# Altium project MB1296-STM32_LRA_Disco.PrjPcb
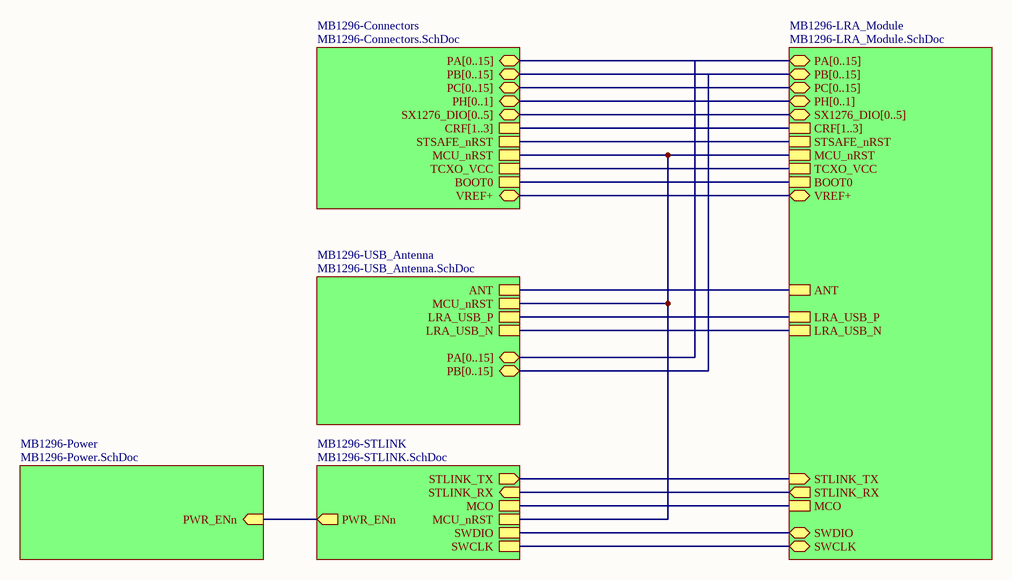
[diagram p0: MB1296-Top.SchDoc]
6 sheets, 178 parts. Net scope: hierarchical (ports join the sheet entries above them; power ports are global).
Board file: MB1296-STM32_LRA_Disco_revC01.PcbDoc
Sheets:
  MB1296-Top.SchDoc
    MB1296-Connectors = MB1296-Connectors.SchDoc
    MB1296-USB_Antenna = MB1296-USB_Antenna.SchDoc
    MB1296-STLINK = MB1296-STLINK.SchDoc
    MB1296-LRA_Module = MB1296-LRA_Module.SchDoc
    MB1296-Power = MB1296-Power.SchDoc

## Sheet MB1296-Top.SchDoc: Top
size A4; Date: 18-AUG-2016; Organization: STMicroelectronics; Address1: Microcontrollers Division; Address2: 190, avenue Célestin COQ; Address3: 13106 ROUSSET Cedex; Address4: FRANCE; DocumentNumber: MB1296; Revision: C-01; SheetNumber: 1; SheetTotal: 6; Project: STM32 LoRa Discovery

### Sub-sheets
MB1296-Connectors = MB1296-Connectors.SchDoc: PA[0..15] (bidir), PB[0..15] (bidir), PC[0..15] (bidir), MCU_nRST, BOOT0, SX1276_DIO[0..5] (bidir), CRF[1..3], TCXO_VCC, PH[0..1] (bidir), STSAFE_nRST, VREF+
MB1296-LRA_Module = MB1296-LRA_Module.SchDoc: LRA_USB_P, LRA_USB_N, STLINK_TX (in), STLINK_RX (out), ANT, STSAFE_nRST, MCU_nRST, TCXO_VCC, MCO, PA[0..15] (bidir), PB[0..15] (bidir), PC[0..15] (bidir), SX1276_DIO[0..5] (bidir), CRF[1..3], BOOT0, PH[0..1] (bidir), SWDIO, SWCLK, VREF+
MB1296-Power = MB1296-Power.SchDoc: PWR_ENn (in)
MB1296-STLINK = MB1296-STLINK.SchDoc: SWCLK, SWDIO, MCO, MCU_nRST, STLINK_RX (in), STLINK_TX (out), PWR_ENn (out)
MB1296-USB_Antenna = MB1296-USB_Antenna.SchDoc: LRA_USB_N, LRA_USB_P, MCU_nRST, ANT, PA[0..15] (bidir), PB[0..15] (bidir)

### Nets
VREF+: sheet MB1296-Connectors/VREF+, sheet MB1296-LRA_Module/VREF+
ANT: sheet MB1296-USB_Antenna/ANT, sheet MB1296-LRA_Module/ANT
BOOT0: sheet MB1296-Connectors/BOOT0, sheet MB1296-LRA_Module/BOOT0
LRA_USB_N: sheet MB1296-USB_Antenna/LRA_USB_N, sheet MB1296-LRA_Module/LRA_USB_N
LRA_USB_P: sheet MB1296-USB_Antenna/LRA_USB_P, sheet MB1296-LRA_Module/LRA_USB_P
MCO: sheet MB1296-STLINK/MCO, sheet MB1296-LRA_Module/MCO
MCU_nRST: sheet MB1296-Connectors/MCU_nRST, sheet MB1296-USB_Antenna/MCU_nRST, sheet MB1296-STLINK/MCU_nRST, sheet MB1296-LRA_Module/MCU_nRST
PA13: sheet MB1296-STLINK/SWDIO, sheet MB1296-LRA_Module/SWDIO
PA14: sheet MB1296-STLINK/SWCLK, sheet MB1296-LRA_Module/SWCLK
PWR_ENn: sheet MB1296-STLINK/PWR_ENn, sheet MB1296-Power/PWR_ENn
STLINK_RX: sheet MB1296-STLINK/STLINK_RX, sheet MB1296-LRA_Module/STLINK_RX
STLINK_TX: sheet MB1296-STLINK/STLINK_TX, sheet MB1296-LRA_Module/STLINK_TX
STSAFE_nRST: sheet MB1296-Connectors/STSAFE_nRST, sheet MB1296-LRA_Module/STSAFE_nRST
TCXO_VCC: sheet MB1296-Connectors/TCXO_VCC, sheet MB1296-LRA_Module/TCXO_VCC

### Buses and harness runs
bus sheet MB1296-Connectors/CRF[1..3] = sheet MB1296-LRA_Module/CRF[1..3]
bus sheet MB1296-Connectors/PA[0..15] = sheet MB1296-LRA_Module/PA[0..15] = sheet MB1296-USB_Antenna/PA[0..15]
bus sheet MB1296-Connectors/PB[0..15] = sheet MB1296-LRA_Module/PB[0..15] = sheet MB1296-USB_Antenna/PB[0..15]
bus sheet MB1296-Connectors/PC[0..15] = sheet MB1296-LRA_Module/PC[0..15]
bus sheet MB1296-Connectors/PH[0..1] = sheet MB1296-LRA_Module/PH[0..1]
bus sheet MB1296-Connectors/SX1276_DIO[0..5] = sheet MB1296-LRA_Module/SX1276_DIO[0..5]

### Notes on the sheet
- Title:
- Project:
- Size:
- Date:
- A4
- Reference:
- Sheet:
- Revision:
- of

## Sheet MB1296-Connectors.SchDoc: Connectors
size A4; Date: 18-AUG-2016; Organization: STMicroelectronics; Address1: Microcontrollers Division; Address2: 190, avenue Célestin COQ; Address3: 13106 ROUSSET Cedex; Address4: FRANCE; DocumentNumber: MB1296; Revision: C-01; SheetNumber: 6; SheetTotal: 6; Project: STM32 LoRa Discovery
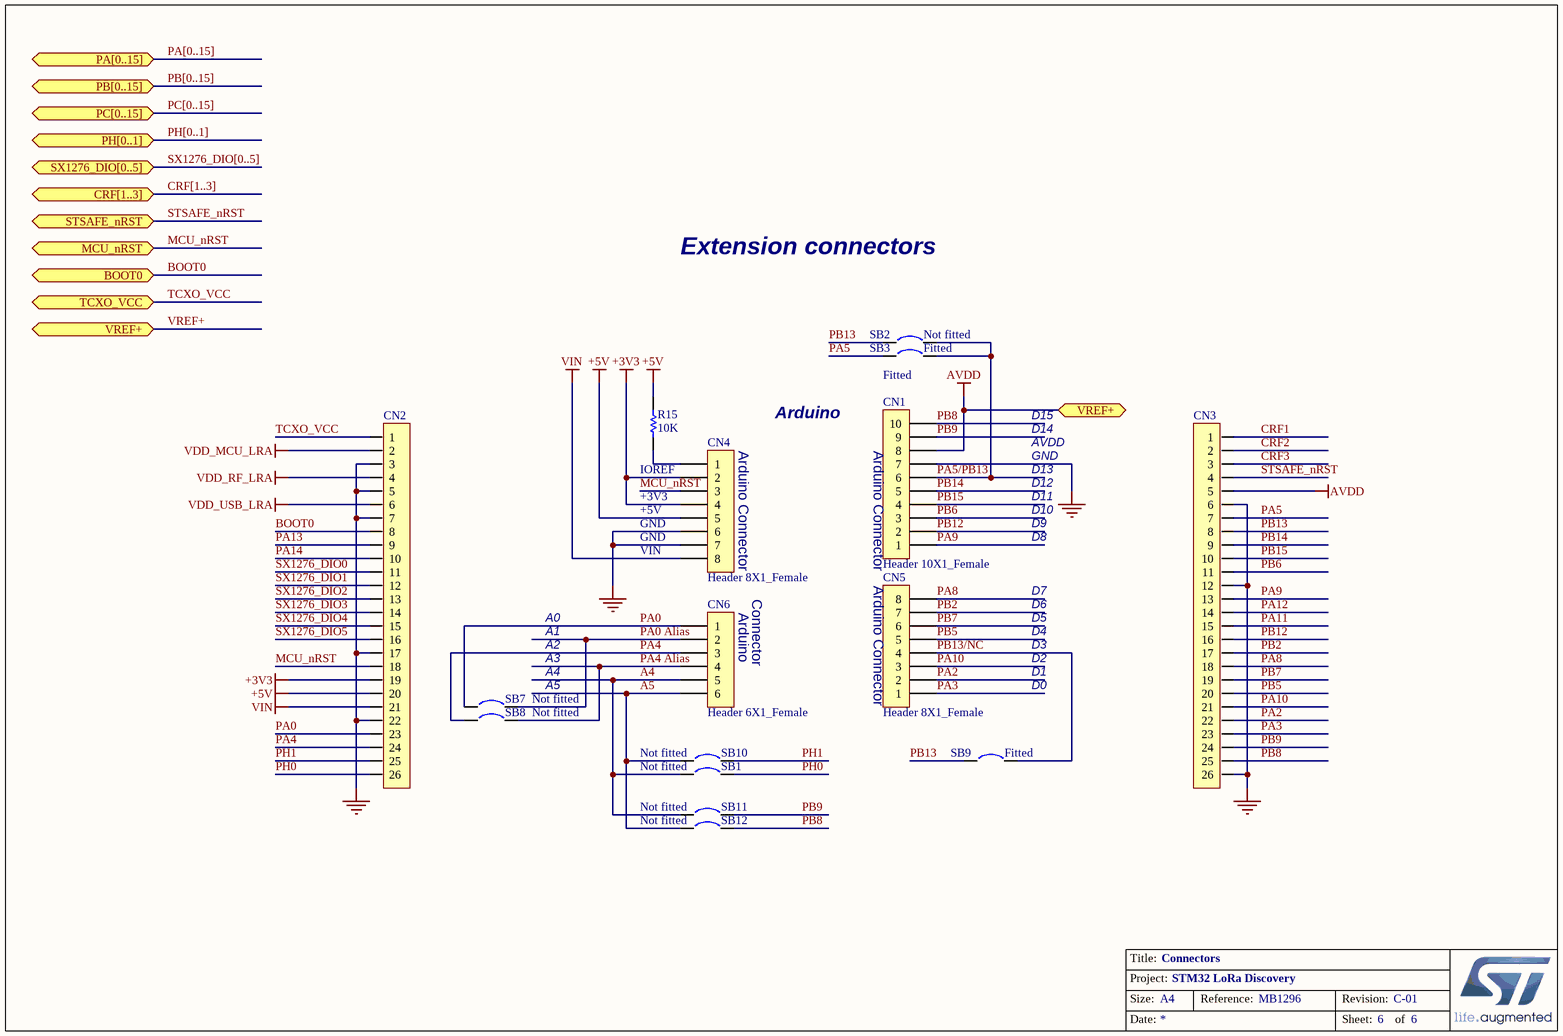
[diagram p1: MB1296-Connectors.SchDoc]

### Parts
CN1  Header 10X1_Female  [Header 1x10 Female (Wrapping)]
CN2  (no value)  [HEADER 1X26 (2.54) Male]
CN3  (no value)  [HEADER 1X26 (2.54) Male]
CN4  Header 8X1_Female  [Header 1x8Female (Wrapping)]
CN5  Header 8X1_Female  [Header 1x8Female (Wrapping)]
CN6  Header 6X1_Female  [Header 1x6 Female (Wrapping)]
R15  10K  [0603R]
SB1  Circuit Breaker  [JP2_SMD]  (value not drawn)
SB2  Circuit Breaker  [JP2_SMD]  (value not drawn)
SB3  Circuit Breaker  [JP2_SMD]  (value not drawn)
SB7  Circuit Breaker  [JP2_SMD]  (value not drawn)
SB8  Circuit Breaker  [JP2_SMD]  (value not drawn)
SB9  Circuit Breaker  [JP2_SMD]  (value not drawn)
SB10  Circuit Breaker  [JP2_SMD]  (value not drawn)
SB11  Circuit Breaker  [JP2_SMD]  (value not drawn)
SB12  Circuit Breaker  [JP2_SMD]  (value not drawn)

### Ports
BOOT0, CRF[1..3], MCU_nRST, PA[0..15] (bidir), PB[0..15] (bidir), PC[0..15] (bidir), PH[0..1] (bidir), STSAFE_nRST, SX1276_DIO[0..5] (bidir), TCXO_VCC, VREF+

### Nets
+3V3: CN2.19 CN4.2 CN4.4
+5V: CN2.20 CN4.5 R15.1
GND: CN1.7 CN2.3 CN2.5 CN2.7 CN2.17 CN2.22 CN3.6 CN3.12 CN3.26 CN4.6 CN4.7
VDD_RF_LRA: CN2.4
VDD_USB_LRA: CN2.6
VIN: CN2.21 CN4.8
VREF+: CN1.8 CN2.2 CN3.5 ; port VREF+  [also labelled AVDD, VDD_MCU_LRA]
A4: CN6.5 SB1.1 SB11.1
A5: CN6.6 SB10.1 SB12.1
BOOT0: CN2.8 ; port BOOT0
CRF1: CN3.1
CRF2: CN3.2
CRF3: CN3.3
MCU_nRST: CN2.18 CN4.3 ; port MCU_nRST
PA0: CN2.23 CN6.1 SB7.1
PA0 Alias: CN6.2 SB7.2
PA2: CN3.22 CN5.2
PA3: CN3.23 CN5.1
PA4: CN2.24 CN6.3 SB8.1
PA4 Alias: CN6.4 SB8.2
PA5: CN3.7 SB3.1
PA5/PB13: CN1.6 SB2.2 SB3.2
PA8: CN3.18 CN5.8
PA9: CN1.1 CN3.13
PA10: CN3.21 CN5.3
PA11: CN3.15
PA12: CN3.14
PA13: CN2.9
PA14: CN2.10
PB2: CN3.17 CN5.7
PB5: CN3.20 CN5.5
PB6: CN1.3 CN3.11
PB7: CN3.19 CN5.6
PB8: CN1.10 CN3.25 SB12.2
PB9: CN1.9 CN3.24 SB11.2
PB12: CN1.2 CN3.16
PB13: CN3.8 SB2.1 SB9.1
PB13/NC: CN5.4 SB9.2
PB14: CN1.5 CN3.9
PB15: CN1.4 CN3.10
PH0: CN2.26 SB1.2  [project net MCO]
PH1: CN2.25 SB10.2
STSAFE_nRST: CN3.4 ; port STSAFE_nRST
SX1276_DIO0: CN2.11
SX1276_DIO1: CN2.12
SX1276_DIO2: CN2.13
SX1276_DIO3: CN2.14
SX1276_DIO4: CN2.15
SX1276_DIO5: CN2.16
TCXO_VCC: CN2.1 ; port TCXO_VCC
NetCN4_1: CN4.1 R15.2

### Buses and harness runs
bus CRF[1..3] = port CRF[1..3]
bus PA[0..15] = port PA[0..15]
bus PB[0..15] = port PB[0..15]
bus PC[0..15] = port PC[0..15]
bus PH[0..1] = port PH[0..1]
bus SX1276_DIO[0..5] = port SX1276_DIO[0..5]

### Notes on the sheet
- Extension connectors
- (near SB3) Fitted
- (near SB2) Not fitted
- Fitted
- (near CN4) Arduino Connector
- Arduino
- Arduino Connector
- D14
- D15
- AVDD
- IOREF
- +3V3
- +5V
- D10
- D13
- D12
- D11
- GND
- (near CN4) GND
- (near CN4) VIN
- (near CN5) Arduino Connector
- D8
- D9
- A0
- A1
- A2
- (near CN6) Arduino
- Connector
- D4
- D3
- D5
- D6
- D7
- Not fitted
- A3
- A4
- A5
- D0
- D1
- D2
- (near SB10) Not fitted
- (near SB9) Fitted
- (near SB11) Not fitted
- Title:
- Project:
- Size:
- Date:
- Reference:
- Sheet:
- Revision:
- of

### Library data of the parts
CN1 = Header 10X1_Female: Header, 10-Pin, Single row,female; Manufacturer: Lyconn; Manufacturer P/N: 218110S1610; Provided by: Subcon; ECCN_US/UE: *; Fitted: *; Order Code Digikey: *; Order Code Farnell: *; Order Code RS: *; Value: *
CN2 CN3 = CON_SLW-126-01-T-S: Connector header 26x1 2.54mm female; Manufacturer: Samtec; Manufacturer P/N: MTSW-126-22-T-S-265; Fitted: Yes
CN4 CN5 = Header 8X1_Female: Header, 8-Pin, Single row,female; Manufacturer: Lyconn; Manufacturer P/N: 218108S1610; Provided by: Subcon; ECCN_US/UE: *; Fitted: *; Order Code Digikey: *; Order Code Farnell: *; Order Code RS: *; Value: *
CN6 = Header 6X1_Female: Header, 6-Pin, Single row,female; Manufacturer: Lyconn; Manufacturer P/N: 218106S1610; Provided by: Subcon; ECCN_US/UE: *; Fitted: *; Order Code Digikey: *; Order Code Farnell: *; Order Code RS: *; Value: *
R15 = Resistor_ST: Resistor 0603; Manufacturer: YAGEO; Manufacturer P/N: RC0603JR-0710KL; Provided by: Subcon; Value: 10K; ECCN_US/UE: *; Fitted: *; Order Code Digikey: *; Order Code Farnell: *; Order Code RS: *
SB1 SB2 SB7 SB8 SB10-SB12 = Circuit Breaker: Fitted: No; Revision: July-2002: Re-released for DXP Platform.; ECCN_US/UE: *; Manufacturer: *; Manufacturer P/N: *; Order Code Digikey: *; Order Code Farnell: *; Order Code RS: *; Provided by: *; Value: *
SB3 SB9 = Circuit Breaker: Fitted: Yes; Revision: July-2002: Re-released for DXP Platform.; ECCN_US/UE: *; Manufacturer: *; Manufacturer P/N: *; Order Code Digikey: *; Order Code Farnell: *; Order Code RS: *; Provided by: *; Value: *

## Sheet MB1296-USB_Antenna.SchDoc: LoRa USB - Antenna
size A4; Date: 18-AUG-2016; Organization: STMicroelectronics; Address1: Microcontrollers Division; Address2: 190, avenue Célestin COQ; Address3: 13106 ROUSSET Cedex; Address4: FRANCE; DocumentNumber: MB1296; Revision: C-01; SheetNumber: 5; SheetTotal: 6; Project: STM32 LoRa Discovery
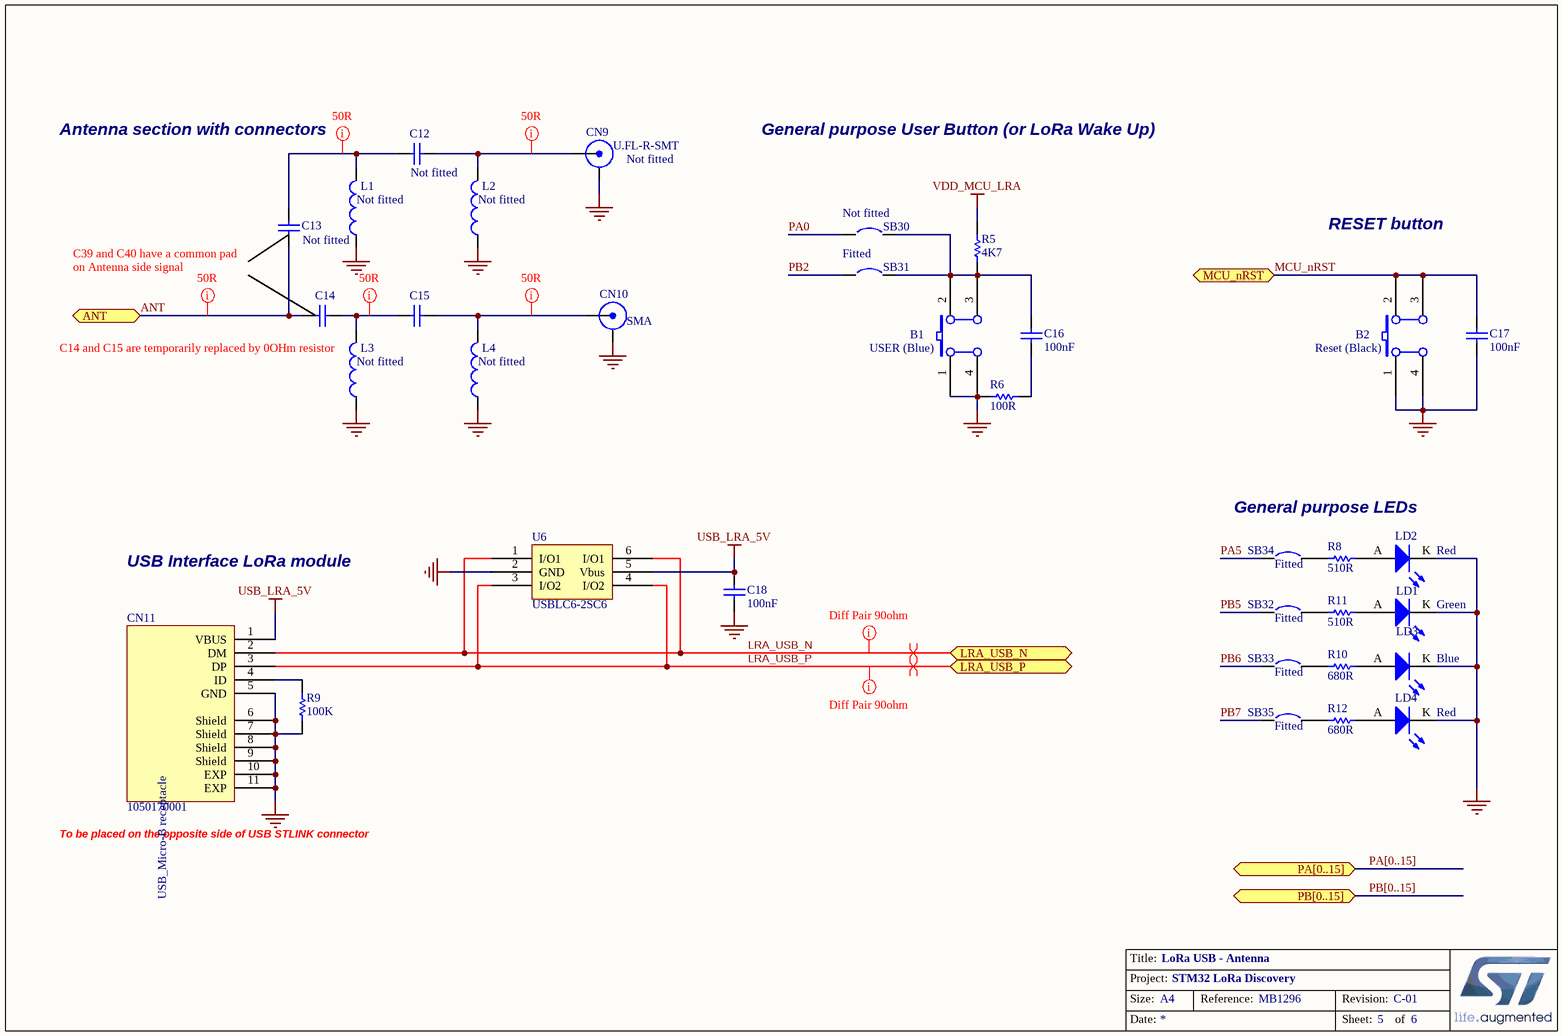
[diagram p2: MB1296-USB_Antenna.SchDoc]

### Parts
B1  USER (Blue)  [PB10]
B2  Reset (Black)  [PB10]
C12  (no value)  [0402]
C13  (no value)  [0402]
C14  (no value)  [0402]
C15  (no value)  [0402]
C16  100nF  [0603C]
C17  100nF  [0603C]
C18  100nF  [0603C]
CN9  U.FL-R-SMT  [UFL-SMD]
CN10  SMA  [SMA_COMBO_B]
CN11  1050170001  [Molex_1050170001]
L1  (no value)  [0402]
L2  (no value)  [0402]
L3  (no value)  [0402]
L4  (no value)  [0402]
LD1  Green  [0603D]
LD2  Red  [0603D]
LD3  Blue  [0603D]
LD4  Red  [0603D]
R5  4K7  [0603R]
R6  100R  [0603R]
R8  510R  [0603R]
R9  100K  [0603]
R10  680R  [0603R]
R11  510R  [0603R]
R12  680R  [0603R]
SB30  Circuit Breaker  [JP2_SMD]  (value not drawn)
SB31  Circuit Breaker  [JP2_SMD]  (value not drawn)
SB32  Circuit Breaker  [JP2_SMD]  (value not drawn)
SB33  Circuit Breaker  [JP2_SMD]  (value not drawn)
SB34  Circuit Breaker  [JP2_SMD]  (value not drawn)
SB35  Circuit Breaker  [JP2_SMD]  (value not drawn)
U6  USBLC6-2SC6  [SOT23-6L]

### Ports
ANT, LRA_USB_N, LRA_USB_P, MCU_nRST, PA[0..15] (bidir), PB[0..15] (bidir)

### Nets
GND: B1.1(A0) B1.4(A1) B2.1(A0) B2.4(A1) C17.1 C18.1 CN9.2(Y) CN10.2(Y) CN11.5(GND) CN11.6(Shield) CN11.7(Shield) CN11.8(Shield) CN11.9(Shield) CN11.10(EXP) CN11.11(EXP) L1.1 L2.1 L3.1 L4.1 LD1.K LD2.K LD3.K LD4.K R6.2 R9.1 U6.2(GND)
USB_LRA_5V: C18.2 CN11.1(VBUS) U6.5(Vbus)
VDD_MCU_LRA: R5.2  [project net VREF+]
ANT: C13.2 C14.1 ; port ANT
LRA_USB_N: CN11.2(DM) U6.1(I/O1) U6.6(I/O1) ; port LRA_USB_N
LRA_USB_P: CN11.3(DP) U6.3(I/O2) U6.4(I/O2) ; port LRA_USB_P
MCU_nRST: B2.2(B0) B2.3(B1) C17.2 ; port MCU_nRST
PA0: SB30.1
PA5: SB34.1
PB2: SB31.1
PB5: SB32.1
PB6: SB33.1
PB7: SB35.1
NetB1_2: B1.2(B0) B1.3(B1) C16.2 R5.1 SB30.2 SB31.2
NetC12_1: C12.1 C13.1 L1.2
NetC12_2: C12.2 CN9.1(X) L2.2
NetC14_2: C14.2 C15.1 L3.2
NetC15_2: C15.2 CN10.1(X) L4.2
NetC16_1: C16.1 R6.1
NetCN11_4: CN11.4(ID) R9.2
NetLD1_A: LD1.A R11.2
NetLD2_A: LD2.A R8.2
NetLD3_A: LD3.A R10.2
NetLD4_A: LD4.A R12.2
NetR8_1: R8.1 SB34.2
NetR10_1: R10.1 SB33.2
NetR11_1: R11.1 SB32.2
NetR12_1: R12.1 SB35.2

### Buses and harness runs
bus PA[0..15] = port PA[0..15]
bus PB[0..15] = port PB[0..15]

### Layout directives
mark named Diff Pair 90ohm: LRA_USB_N, LRA_USB_P
differential pair: LRA_USB_N, LRA_USB_P
net class 50R; rule Clearance Constraint [Clearance = 6.2mil]: ANT, NetC12_1, NetC12_2, NetC14_2, NetC15_2

### Notes on the sheet
- Antenna section with connectors
- Not fitted
- (near CN9) Not fitted
- General purpose User Button (or LoRa Wake Up)
- (near L1) Not fitted
- (near L2) Not fitted
- (near SB30) Not fitted
- RESET button
- (near C13) C39 and C40 have a common pad
- on Antenna side signal
- Fitted
- (near L3) C14 and C15 are temporarily replaced by 0OHm resistor
- (near L3) Not fitted
- (near L4) Not fitted
- General purpose LEDs
- USB Interface LoRa module
- (near SB34) Fitted
- (near SB32) Fitted
- (near SB33) Fitted
- (near SB35) Fitted
- (near CN11) To be placed on the opposite side of USB STLINK connector
- Title:
- Project:
- Size:
- Date:
- A4
- Reference:
- Sheet:
- Revision:
- of
- (in symbol 1050170001) USB_Micro-B receptacle

### Library data of the parts
B1 = SW PUSHBUTTON: SE PUSHBUTTON; Manufacturer: wealthmetal; Manufacturer P/N: TD0341X-G01-BLU; Provided by: Subcon; ECCN_US/UE: *; Fitted: *; Order Code Digikey: *; Order Code Farnell: *; Order Code RS: *; Value: *
B2 = SW PUSHBUTTON: SE PUSHBUTTON; Manufacturer: wealthmetal; Manufacturer P/N: TD0341X-G01-BLA; Provided by: Subcon; ECCN_US/UE: *; Fitted: *; Order Code Digikey: *; Order Code Farnell: *; Order Code RS: *; Value: *
C12 C13 = CAP SMD 0402 NPO 18PF 16V 5%: 0402; Fitted: No; Manufacturer: *; Manufacturer P/N: *; Order code Farnell: *; Order code RS: *; Value: *; ECCN_US/UE: *; Order Code Digikey: *; Provided by: *
C14 C15 = CAP SMD 0402 NPO 18PF 16V 5%: 0402; Fitted: Yes 0Ohm resistor; Manufacturer: *; Manufacturer P/N: *; Order code Farnell: *; Order code RS: *; Value: *; ECCN_US/UE: *; Order Code Digikey: *; Provided by: *
C16-C18 = CAP: Capacitor 100nF; Manufacturer: YAGEO; Manufacturer P/N: CC0603KRX7R9BB104; Provided by: Subcon; Revision: July-2002: Re-released for DXP Platform.; Value: 100nF; ECCN_US/UE: *; Fitted: *; Order Code Digikey: *; Order Code Farnell: *; Order Code RS: *
CN9 = UFL
CN11 = 1050170001: Silkscreen: USB
L1-L4 = BLM15HG102SN1D: Fitted: No; Manufacturer: *; Manufacturer P/N: *; Order Code Mouser: *; ECCN_US/UE: *; Order Code Digikey: *; Order Code Farnell: *; Order Code RS: *; Provided by: *; Value: *
LD1-LD4 = LED2: Typical RED, GREEN, YELLOW, AMBER GaAs LED; Manufacturer: Everlight; Manufacturer P/N  Green: 19-213SY6C/S530-E2/TR8LED; Manufacturer P/N  Red: 19-213-R6C-AP1Q2B-3T; Revision: July-2002: Re-released for DXP Platform.; ECCN_US/UE: *; Fitted: *; Order Code Digikey: *; Order Code Farnell: *; Order Code RS: *; Provided by: *; Value: *
R5 = res1_4: Resistor; Manufacturer: YAGEO; Manufacturer P/N: RC0603FR-074K7L; Provided by: Subcon; Revision: July-2002: Re-released for DXP Platform.; ECCN_US/UE: *; Fitted: *; Order Code Digikey: *; Order Code Farnell: *; Order Code RS: *; Value: 4K7
R6 = res1_4: Resistor; Manufacturer: YAGEO; Manufacturer P/N: RC0603FR-07100RL; Provided by: Subcon; Revision: July-2002: Re-released for DXP Platform.; ECCN_US/UE: *; Fitted: *; Order Code Digikey: *; Order Code Farnell: *; Order Code RS: *; Value: 100R
R8 R11 = res1_4: Resistor; Manufacturer: YAGEO; Manufacturer P/N: RC0603FR-07510RL; Provided by: Subcon; Revision: July-2002: Re-released for DXP Platform.; ECCN_US/UE: *; Fitted: *; Order Code Digikey: *; Order Code Farnell: *; Order Code RS: *; Value: 510R
R9 = RES SMD 0603 100K 75V 5% 0.1W: 0603 100K 75V 5% 0.1W; Manufacturer: YAGEO; Manufacturer P/N: RC0603FR-07100KL; Provided by: Subcon; Order code Farnell: 1692517; Value: 100K; ECCN_US/UE: *; Fitted: *; Order Code Digikey: *
R10 R12 = res1_4: Resistor; Manufacturer: YAGEO; Manufacturer P/N: RC0603FR-07680RL; Provided by: Subcon; Revision: July-2002: Re-released for DXP Platform.; ECCN_US/UE: *; Fitted: *; Order Code Digikey: *; Order Code Farnell: *; Order Code RS: *; Value: 680R
SB30 = Circuit Breaker: Fitted: No; Revision: July-2002: Re-released for DXP Platform.; ECCN_US/UE: *; Manufacturer: *; Manufacturer P/N: *; Order Code Digikey: *; Order Code Farnell: *; Order Code RS: *; Provided by: *; Value: *
SB31-SB35 = Circuit Breaker: Fitted: Yes; Revision: July-2002: Re-released for DXP Platform.; ECCN_US/UE: *; Manufacturer: *; Manufacturer P/N: *; Order Code Digikey: *; Order Code Farnell: *; Order Code RS: *; Provided by: *; Value: *
U6 = USBLC6-2SC6: Manufacturer: STMicroelectronics; Manufacturer P/N: USBLC6-4SC6; ECCN_US/UE: EAR99/NEC; Provided by: STM; Fitted: *; Order Code Digikey: *; Order Code Farnell: *; Order Code RS: *; Value: *

## Sheet MB1296-STLINK.SchDoc: STLINK/V2-1
size A4; Date: 18-AUG-2016; DocumentNumber: MB1296; Revision: C-01; SheetNumber: 3; SheetTotal: 6; Project: STM32 LoRa Discovery
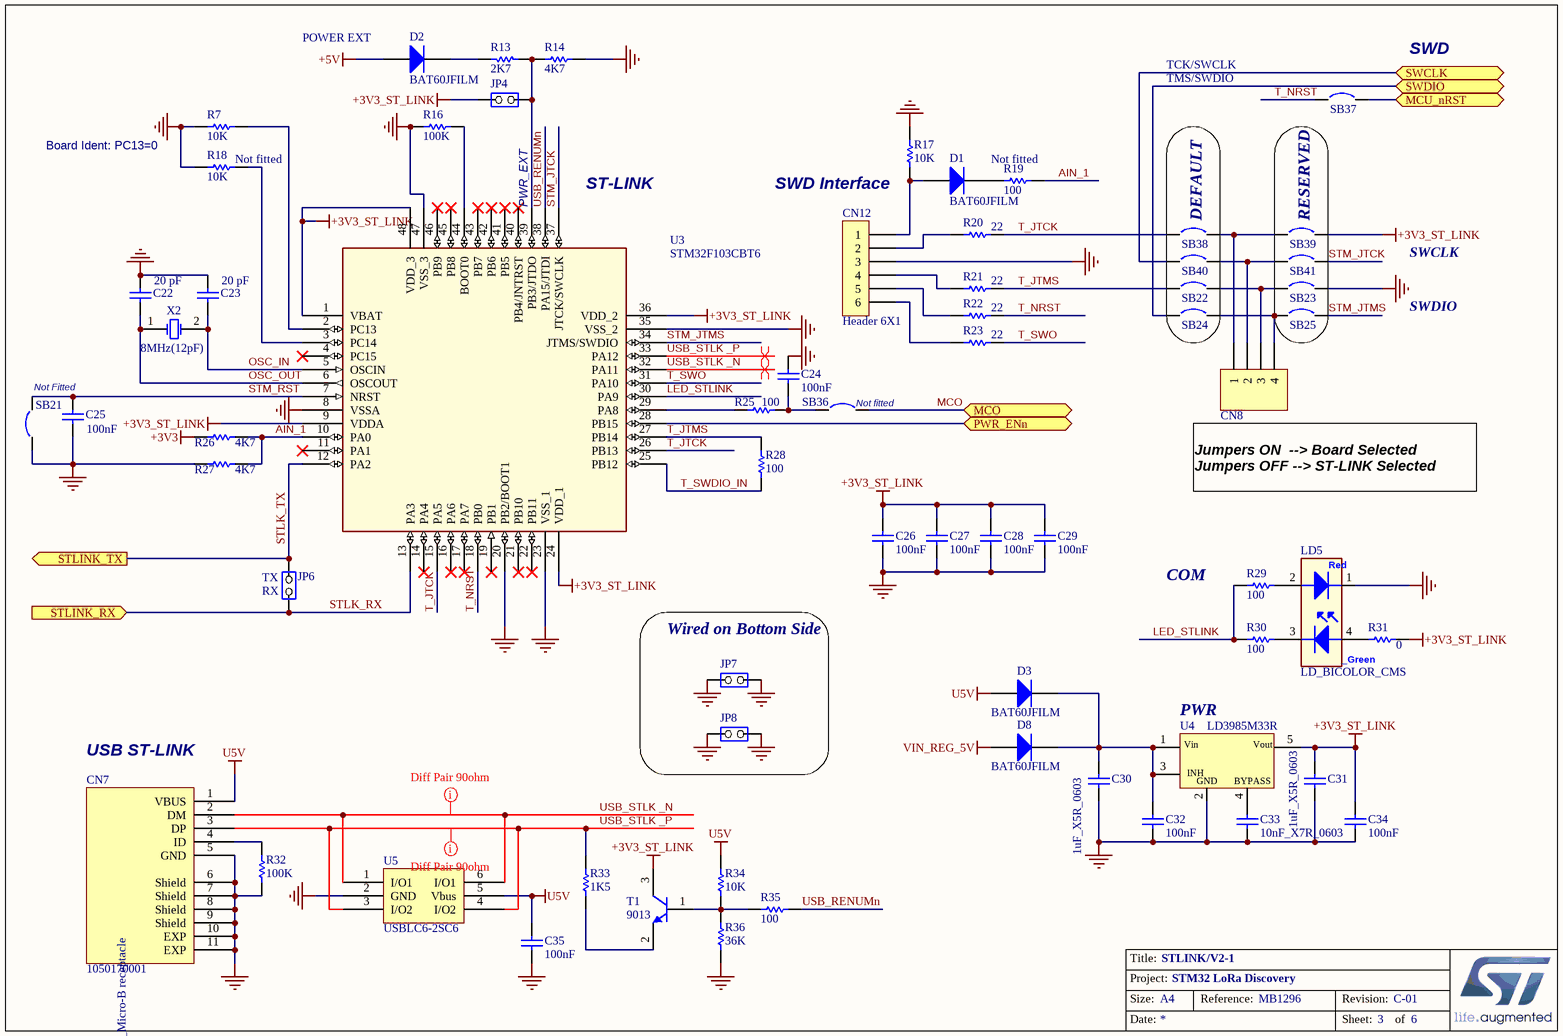
[diagram p3: MB1296-STLINK.SchDoc]

### Parts
C22  20 pF  [0603C]
C23  20 pF  [0603C]
C24  100nF  [0603C]
C25  100nF  [0603C]
C26  100nF  [0603C]
C27  100nF  [0603C]
C28  100nF  [0603C]
C29  100nF  [0603C]
C30  1uF_X5R_0603  [0603C]
C31  1uF_X5R_0603  [0603C]
C32  100nF  [0603C]
C33  10nF_X7R_0603  [0603C]
C34  100nF  [0603C]
C35  100nF  [0603C]
CN7  1050170001  [Molex_1050170001]
CN8  Header 4  [SIP4]  (value not drawn)
CN12  Header 6X1  [Header 1x6 Female (Wrapping)]
D1  BAT60JFILM  [SOD323/A]
D2  BAT60JFILM  [SOD323/A]
D3  BAT60JFILM  [SOD323/A]
D8  BAT60JFILM  [SOD323/A]
JP4  (no value)  [SIP2/2.54]
JP6  (no value)  [SIP2/2.54]
JP7  (no value)  [SIP2/2.54-BOT]
JP8  (no value)  [SIP2/2.54-BOT]
LD5  LD_BICOLOR_CMS  [LED SMD HSMF-A201-A00J1]
R7  10K  [0603]
R13  2K7  [0603]
R14  4K7  [0603]
R16  100K  [0603]
R17  10K  [0603]
R18  10K  [0603]
R19  100  [0603]
R20  22  [0603]
R21  22  [0603]
R22  22  [0603]
R23  22  [0603]
R25  100  [0603]
R26  4K7  [0603]
R27  4K7  [0603]
R28  100  [0603]
R29  100  [0603]
R30  100  [0603]
R31  0  [0603]
R32  100K  [0603]
R33  1K5  [0603]
R34  10K  [0603]
R35  100  [0603]
R36  36K  [0603]
SB21  Circuit Breaker  [JP2_SMD]  (value not drawn)
SB22  Circuit Breaker  [JP2_SMD]  (value not drawn)
SB23  Circuit Breaker  [SB-tiny]  (value not drawn)
SB24  Circuit Breaker  [JP2_SMD]  (value not drawn)
SB25  Circuit Breaker  [SB-tiny]  (value not drawn)
SB36  Circuit Breaker  [JP2_SMD]  (value not drawn)
SB37  Circuit Breaker  [JP2_SMD]  (value not drawn)
SB38  Circuit Breaker  [JP2_SMD]  (value not drawn)
SB39  Circuit Breaker  [SB-tiny]  (value not drawn)
SB40  Circuit Breaker  [JP2_SMD]  (value not drawn)
SB41  Circuit Breaker  [SB-tiny]  (value not drawn)
T1  9013  [SOT-23]
U3  STM32F103CBT6  [QFP48 7X7]
U4  LD3985M33R  [SOT-23-5L]
U5  USBLC6-2SC6  [SOT23-6L]
X2  8MHz(12pF)  [CRY_NX3225GD_2P]

### Blocks framed on the sheet
DEFAULT: SB22 SB24 SB38 SB40
RESERVED: SB23 SB25 SB39 SB41
Wired on Bottom Side: JP7 JP8

### Ports
MCO, MCU_nRST, PWR_ENn (bidir), STLINK_RX (in), STLINK_TX (out), SWCLK, SWDIO

### Nets
+3V3: R26.1
+3V3_ST_LINK: C26.2 C27.2 C28.2 C29.2 C31.2 C34.2 JP4.1(COMMON) R31.2 SB39.2 T1.3(C) U3.1(VBAT) U3.9(VDDA) U3.24(VDD_1) U3.36(VDD_2) U3.48(VDD_3) U4.5(Vout)
+5V: D2.1(A)
GND: C22.2 C23.2 C24.2 C25.1 C26.1 C27.1 C28.1 C29.1 C30.1 C31.1 C32.1 C33.1 C34.1 C35.1 CN7.5(GND) CN7.6(Shield) CN7.7(Shield) CN7.8(Shield) CN7.9(Shield) CN7.10(EXP) CN7.11(EXP) CN12.3 JP7.1(COMMON) JP7.2(NO) JP8.1(COMMON) JP8.2(NO) LD5.1 R7.2 R14.2 R16.2 R17.1 R18.2 R27.1 R32.1 R36.1 SB21.1 SB23.2 U3.8(VSSA) U3.20(PB2/BOOT1) U3.23(VSS_1) U3.35(VSS_2) U3.47(VSS_3) U4.2(GND) U5.2(GND)
U5V: C35.2 CN7.1(VBUS) D3.1(A) R34.1 U5.5(Vbus)
VIN_REG_5V: D8.1(A)
AIN_1: R19.1 R26.2 R27.2 U3.10(PA0)
LED_STLINK: R29.2 R30.2 U3.30(PA9)
MCO: SB36.2 ; port MCO
MCU_nRST: SB37.2 ; port MCU_nRST
OSC_IN: C23.1 U3.5(OSCIN) X2.2(OSC2)
OSC_OUT: C22.1 U3.6(OSCOUT) X2.1(OSC1)
PA13: SB24.1 ; port SWDIO
PA14: SB40.1 ; port SWCLK
PWR_ENn: U3.28(PB15) ; port PWR_ENn
STLK_RX: JP6.1(COMMON) U3.13(PA3) ; port STLINK_RX  [project net STLINK_RX]
STLK_TX: JP6.2(NO) U3.12(PA2) ; port STLINK_TX  [project net STLINK_TX]
STM_JTCK: SB41.2 U3.37(JTCK/SWCLK)
STM_JTMS: SB25.2 U3.34(JTMS/SWDIO)
STM_RST: C25.2 SB21.2 U3.7(NRST)
T_JTCK: R20.1 SB38.1 U3.15(PA5) U3.26(PB13)
T_JTMS: R21.1 R28.2 SB22.1 U3.27(PB14)
T_NRST: R22.1 SB37.1 U3.18(PB0)
T_SWDIO_IN: R28.1 U3.25(PB12)
T_SWO: R23.1 U3.31(PA10)
USB_RENUMn: R35.1 U3.38(PA15/JTDI)
USB_STLK _N: CN7.2(DM) U3.32(PA11) U5.1(I/O1) U5.6(I/O1)
USB_STLK _P: CN7.3(DP) R33.2 U3.33(PA12) U5.3(I/O2) U5.4(I/O2)
NetC24_1: C24.1 R25.1 SB36.1
NetC30_2: C30.2 C32.2 D3.2(K) D8.2(K) U4.1(Vin) U4.3(CE)
NetC33_2: C33.2 U4.4(BYPASS)
NetCN7_4: CN7.4(ID) R32.2
NetCN8_1: CN8.1 SB38.2 SB39.1
NetCN8_2: CN8.2 SB40.2 SB41.1
NetCN8_3: CN8.3 SB22.2 SB23.1
NetCN8_4: CN8.4 SB24.2 SB25.1
NetCN12_1: CN12.1 D1.1(A) R17.2
NetCN12_2: CN12.2 R20.2
NetCN12_4: CN12.4 R21.2
NetCN12_5: CN12.5 R22.2
NetCN12_6: CN12.6 R23.2
NetD1_2: D1.2(K) R19.2
NetD2_2: D2.2(K) R13.1
NetJP4_2: JP4.2(NO) R13.2 R14.1 U3.39(PB3/JTDO)
NetLD5_2: LD5.2 R29.1
NetLD5_3: LD5.3 R30.1
NetLD5_4: LD5.4 R31.1
NetR7_1: R7.1 U3.2(PC13)
NetR16_1: R16.1 U3.44(BOOT0)
NetR18_1: R18.1 U3.3(PC14)
NetR25_2: R25.2 U3.29(PA8)
NetR33_1: R33.1 T1.2(E)
NetR34_2: R34.2 R35.2 R36.2 T1.1(B)

Not connected (* = marked no-connect by the designer): U3 4(PC15)* 11(PA1)* 14(PA4)* 16(PA6)* 17(PA7)* 19(PB1)* 21(PB10)* 22(PB11)* 40(PB4/JNTRST)* 41(PB5)* 42(PB6)* 43(PB7)* 45(PB8)* 46(PB9)*

### Layout directives
differential pair: USB_STLK _N, USB_STLK _P
mark named Diff Pair 90ohm: USB_STLK _N, USB_STLK _P

### Notes on the sheet
- POWER EXT
- TCK/SWCLK
- TMS/SWDIO
- SWD
- Board Ident: PC13=0
- (near R18) Not fitted
- (near R19) Not fitted
- (near U3) PWR_EXT
- ST-LINK
- SWD Interface
- SWCLK
- SWDIO
- Not Fitted
- (near SB36) Not fitted
- Jumpers ON  --> Board Selected
  Jumpers OFF --> ST-LINK Selected
- (near JP6) TX
- COM
- (near JP6) RX
- (near U4) PWR
- (near CN7) USB ST-LINK
- Title:
- Project:
- Size:
- Date:
- A4
- Reference:
- Sheet:
- Revision:
- of
- (in symbol 1050170001) USB_Micro-B receptacle
- (in symbol LD3985M33R) INH
- (in symbol LD_BICOLOR_CMS) Red; _Green

### Library data of the parts
C22 C23 = Capacitor_ST: Capacitor 0603; Manufacturer: YAGEO; Manufacturer P/N: CC0603JRNPO9BN200; Value: 20pF; Provided by: Subcon; Revision: July-2002: Re-released for DXP Platform.; ECCN_US/UE: *; Fitted: *; Order Code Digikey: *; Order Code Farnell: *; Order Code RS: *
C24-C29 C32 C34 C35 = CAP: as C16 on sheet MB1296-USB_Antenna; Revision: July-2002: Re-released for DXP Platform.; Value: 100nF; ECCN_US/UE: *; Fitted: *; Order Code Digikey: *; Order Code Farnell: *; Order Code RS: *
C30 C31 = CAP SMD 0603  X5R 1µF 25V 10%: 0603  X5R 1µF; Manufacturer: YAGEO; Manufacturer P/N: CC0603KRX5R7BB105; Provided by: Subcon; Order code Farnell: 1288202RL; Value: 1µF; ECCN_US/UE: *; Fitted: *; Order Code Digikey: *
C33 = CAP SMD 0603  X7R 10000PF 50V 10%: 0603  X7R 10NF; Manufacturer: YAGEO; Manufacturer P/N: CC0603KRX7R9BB103; Order code RS: 2040779; Provided by: Subcon; Order code Farnell: 7569548RL; Value: 10NF; ECCN_US/UE: *; Fitted: *; Order Code Digikey: *
CN7 = 1050170001: Silkscreen: USB
CN8 = Header 4: Header, 4-Pin, Single row; Manufacturer: Lyconn; Manufacturer P/N: 313140S111116; Provided by: Subcon; Revision: 17-Jul-2002: Re-released for DXP Platform.; ECCN_US/UE: *; Fitted: *; Order Code Digikey: *; Order Code Farnell: *; Order Code RS: *; Value: *
CN12 = Header 6X1: Header, 6-Pin, Single row; Manufacturer: Lyconn; Manufacturer P/N: 218106S1610; Provided by: Subcon; ECCN_US/UE: *; Fitted: *; Order Code Digikey: *; Order Code Farnell: *; Order Code RS: *; Value: *
D1-D3 D8 = BAT60JFILM: Manufacturer: STM; ECCN_US/EU: EAR99/NEC; Provided by: ST; Manufacturer P/N: BAT60JFILM; Fitted: *
JP4 JP6-JP8 = JP2: Manufacturer: Lyconn; Manufacturer P/N: 313140S111116; Provided by: Subcon; ECCN_US/UE: *; Fitted: *; Order Code Digikey: *; Order Code Farnell: *; Order Code RS: *; Value: *
LD5 = LD_BICOLOR_CMS: Bicolor Led; Manufacturer: everluck-led; Manufacturer P/N: LE-RGW35280; Provided by: Subcon; ECCN_US/UE: *; Fitted: *; Order Code Digikey: *; Order Code Farnell: *; Order Code RS: *; Value: *
R7 R17 R34 = Resistor_ST: as R15 on sheet MB1296-Connectors; Value: 10K; ECCN_US/UE: *; Fitted: *; Order Code Digikey: *; Order Code Farnell: *; Order Code RS: *
R13 R36 = Res1: Resistor; Value: 1K; Published: 8-Jun-2000; Revision: July-2002: Re-released for DXP Platform.; Publisher: Altium Limited
R14 R26 R27 = res1_4: as R5 on sheet MB1296-USB_Antenna; Revision: July-2002: Re-released for DXP Platform.; ECCN_US/UE: *; Fitted: *; Order Code Digikey: *; Order Code Farnell: *; Order Code RS: *; Value: 4K7
R16 R32 = RES SMD 0603 100K 75V 5% 0.1W: as R9 on sheet MB1296-USB_Antenna; Order code Farnell: 1692517; Value: 100K; ECCN_US/UE: *; Fitted: *; Order Code Digikey: *
R18 = Resistor_ST: Resistor 0603; Manufacturer: YAGEO; Manufacturer P/N: RC0603JR-0710KL; Fitted: No; Provided by: Subcon; Value: 10K; ECCN_US/UE: *; Order Code Digikey: *; Order Code Farnell: *; Order Code RS: *
R19 = Res1_1: Resistor 0603; Manufacturer: YAGEO; Manufacturer P/N: RC0603FR-07100RL; Fitted: No; Provided by: Subcon; Value: 100R; ECCN_US/UE: *; Order Code Digikey: *; Order Code Farnell: *; Order Code RS: *
R20-R23 = Res1_1: Resistor 0603; Manufacturer: YAGEO; Manufacturer P/N: RC0603FR-0722RL; Provided by: Subcon; Value: 100R; ECCN_US/UE: *; Fitted: *; Order Code Digikey: *; Order Code Farnell: *; Order Code RS: *
R25 R28-R30 R35 = Res1_1: Resistor 0603; Manufacturer: YAGEO; Manufacturer P/N: RC0603FR-07100RL; Provided by: Subcon; Value: 100R; ECCN_US/UE: *; Fitted: *; Order Code Digikey: *; Order Code Farnell: *; Order Code RS: *
R31 = Resistor_ST: Resistor 0402 / 0603 / 0805; Value: 10K
R33 = RES SMD 0603 100K 75V 5% 0.1W: 0603 1K5 75V 5% 0.1W; Manufacturer: YAGEO; Manufacturer P/N: RC0603FR-071K5L; Provided by: Subcon; Value: 1K5; ECCN_US/UE: *; Fitted: *; Order Code Digikey: *
SB21 SB23 SB25 SB36 SB39 SB41 = Circuit Breaker: Fitted: No; Revision: July-2002: Re-released for DXP Platform.; ECCN_US/UE: *; Manufacturer: *; Manufacturer P/N: *; Order Code Digikey: *; Order Code Farnell: *; Order Code RS: *; Provided by: *; Value: *
SB22 SB24 SB37 SB38 SB40 = Circuit Breaker: Fitted: Yes; Revision: July-2002: Re-released for DXP Platform.; ECCN_US/UE: *; Manufacturer: *; Manufacturer P/N: *; Order Code Digikey: *; Order Code Farnell: *; Order Code RS: *; Provided by: *; Value: *
T1 = NPN: NPN Bipolar Transistor; Manufacturer: STMicroelectronics; Manufacturer P/N: MMBT9013; ECCN_US/UE: EAR99/NEC; Provided by: STM; Revision: July-2002: Re-released for DXP Platform.; Fitted: *; Order Code Digikey: *; Order Code Farnell: *; Order Code RS: *; Value: *
U3 = STM32F103CBT6: Medium-density performance line ARM-based 32-bit MCU with 64KB Flash; Manufacturer P/N: STM32F103C8T6; Manufacturer: STM; Ref STM: 9175981; Provided by: ST; ECCN_US/EU: 3A991A2/NEC; Order: STM32F103C8T6; Fitted: *; Order Code Digikey: *; Order Code Farnell: *; Order Code RS: *; Value: *
U4 = LD3985M33R: Ultra low drop-low noise BiCMOS voltage, regulators low ESR capacitors compatible; Manufacturer: STM; Ref St: 9176161; ECCN_US/EU: EAR99/NEC; Manufacturer P/N: LD3985M33R; Provided by: STM; Fitted: *; Order Code Farnell: *; Order Code RS: *
U5 = USBLC6-2SC6: as U6 on sheet MB1296-USB_Antenna; Fitted: *; Order Code Digikey: *; Order Code Farnell: *; Order Code RS: *; Value: *
X2 = XTAL: Crystal Oscillator; Manufacturer: HongKongCrystal; Manufacturer P/N: 9SL8000012AFXHF0-SJ28; Provided by: Subcon; ECCN_US/UE: *; Fitted: *; Order Code Digikey: *; Order Code Farnell: *; Order Code RS: *; Value: 8MHz

## Sheet MB1296-LRA_Module.SchDoc: LoRa Module
size A4; Date: 18-AUG-2016; Organization: STMicroelectronics; Address1: Microcontrollers Division; Address2: 190, avenue Célestin COQ; Address3: 13106 ROUSSET Cedex; Address4: FRANCE; DocumentNumber: MB1296; Revision: C-01; SheetNumber: 4; SheetTotal: 6; Project: STM32 LoRa Discovery
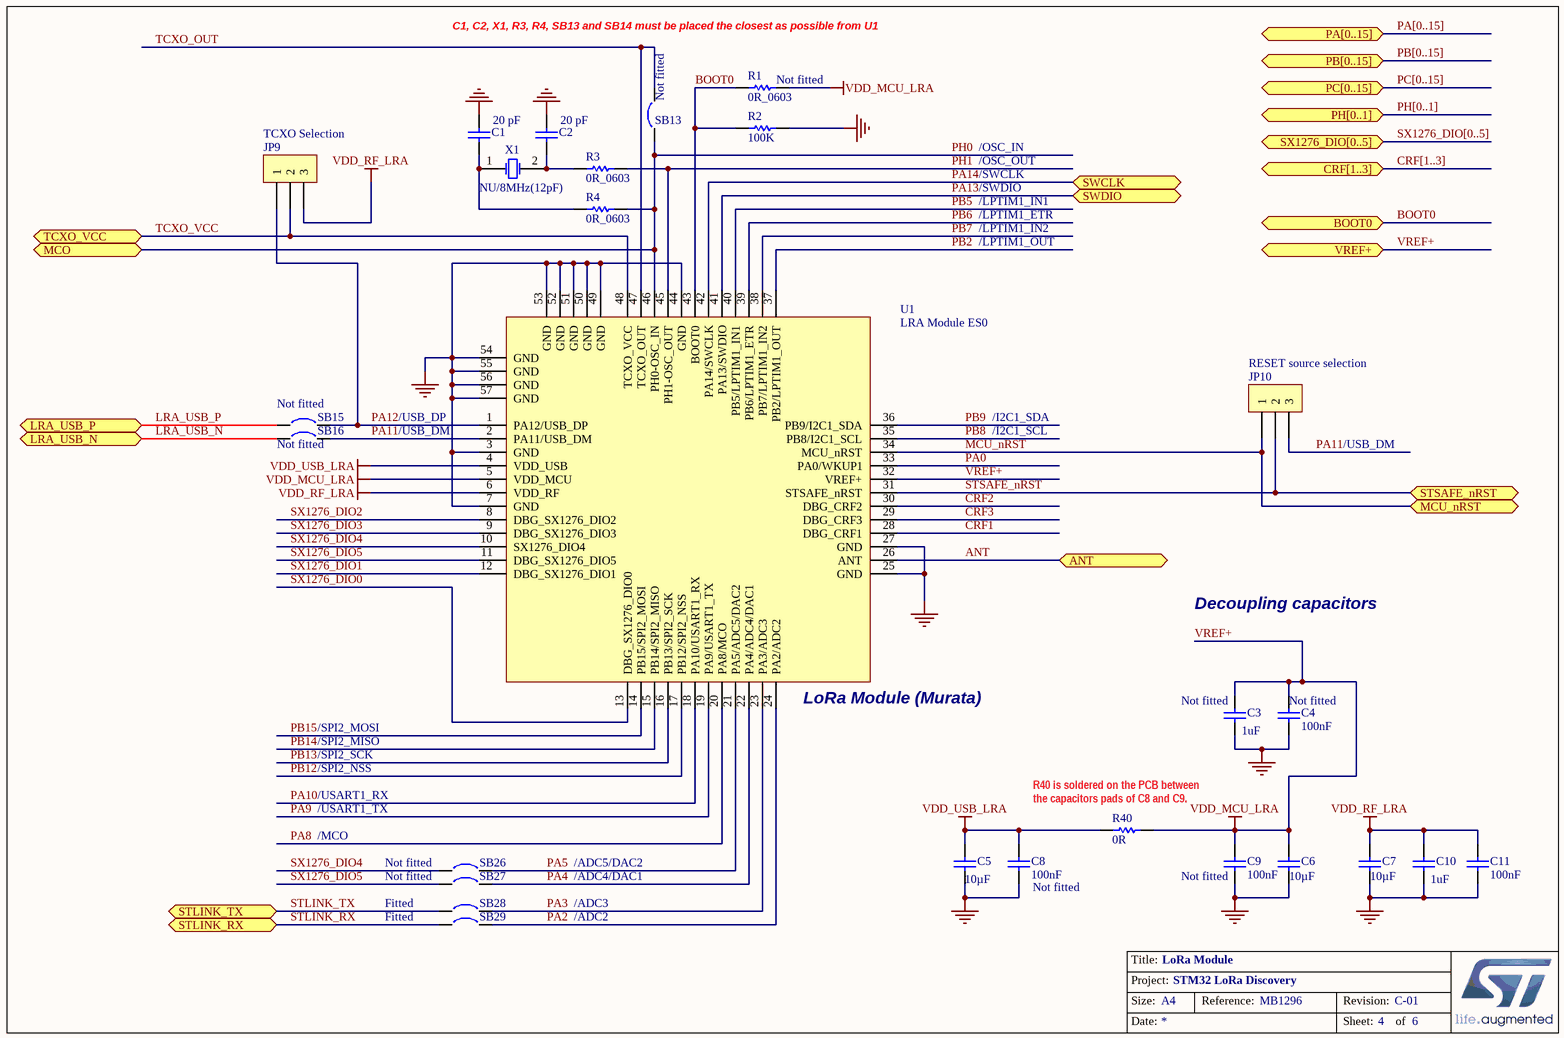
[diagram p4: MB1296-LRA_Module.SchDoc]

### Parts
C1  20 pF  [0603C]
C2  20 pF  [0603C]
C3  1uF  [0603C]
C4  100nF  [0603C]
C5  10µF  [0603C]
C6  10µF  [0603C]
C7  10µF  [0603C]
C8  100nF  [0603C]
C9  100nF  [0603C]
C10  1uF  [0603C]
C11  100nF  [0603C]
JP9  TCXO Selection  [SIP3]
JP10  RESET source selection  [SIP3]
R1  0R_0603  [0603]
R2  100K  [0603]
R3  0R_0603  [0603]
R4  0R_0603  [0603]
R40  0R  [0603]
SB13  Circuit Breaker  [JP2_SMD]  (value not drawn)
SB15  Circuit Breaker  [JP2_SMD]  (value not drawn)
SB16  Circuit Breaker  [JP2_SMD]  (value not drawn)
SB26  Circuit Breaker  [JP2_SMD]  (value not drawn)
SB27  Circuit Breaker  [JP2_SMD]  (value not drawn)
SB28  Circuit Breaker  [JP2_SMD]  (value not drawn)
SB29  Circuit Breaker  [JP2_SMD]  (value not drawn)
U1  LRA Module ES0  [Lora Module ES0]
X1  NU/8MHz(12pF)  [CRY_NX3225GD_2P]

### Ports
ANT, BOOT0, CRF[1..3], LRA_USB_N, LRA_USB_P, MCO, MCU_nRST, PA[0..15] (bidir), PB[0..15] (bidir), PC[0..15] (bidir), PH[0..1] (bidir), STLINK_RX, STLINK_TX, STSAFE_nRST, SWCLK, SWDIO, SX1276_DIO[0..5] (bidir), TCXO_VCC, VREF+

### Nets
GND: C1.2 C2.2 C3.1 C4.1 C5.2 C6.2 C7.2 C8.1 C9.1 C10.1 C11.1 R2.1 U1.3(GND) U1.7(GND) U1.25(GND) U1.27(GND) U1.44(GND) U1.49(GND) U1.50(GND) U1.51(GND) U1.52(GND) U1.53(GND) U1.54(GND) U1.55(GND) U1.56(GND) U1.57(GND)
VDD_RF_LRA: C7.1 C10.2 C11.2 JP9.3 U1.6(VDD_RF)
VDD_USB_LRA: C5.1 C8.2 R40.2 U1.4(VDD_USB)
VREF+: C3.2 C4.2 C6.1 C9.2 R1.2 R40.1 U1.5(VDD_MCU) U1.32(VREF+) ; port VREF+  [also labelled VDD_MCU_LRA]
ANT: U1.26(ANT) ; port ANT
BOOT0: R1.1 R2.2 U1.43(BOOT0) ; port BOOT0
CRF1: U1.28(DBG_CRF1)
CRF2: U1.30(DBG_CRF2)
CRF3: U1.29(DBG_CRF3)
LRA_USB_N: SB16.1 ; port LRA_USB_N
LRA_USB_P: SB15.1 ; port LRA_USB_P
MCU_nRST: JP10.1 U1.34(MCU_nRST) ; port MCU_nRST
PA0: U1.33(PA0/WKUP1)
PA2: SB29.2 U1.24(PA2/ADC2)
PA3: SB28.2 U1.23(PA3/ADC3)
PA4: SB27.2 U1.22(PA4/ADC4/DAC1)
PA5: SB26.2 U1.21(PA5/ADC5/DAC2)
PA8: U1.20(PA8/MCO)
PA9: U1.19(PA9/USART1_TX)
PA10: U1.18(PA10/USART1_RX)
PA11: JP10.3 SB16.2 U1.2(PA11/USB_DM)
PA12: JP9.1 SB15.2 U1.1(PA12/USB_DP)
PA13: U1.41(PA13/SWDIO) ; port SWDIO
PA14: U1.42(PA14/SWCLK) ; port SWCLK
PB2: U1.37(PB2/LPTIM1_OUT)
PB5: U1.40(PB5/LPTIM1_IN1)
PB6: U1.39(PB6/LPTIM1_ETR)
PB7: U1.38(PB7/LPTIM1_IN2)
PB8: U1.35(PB8/I2C1_SCL)
PB9: U1.36(PB9/I2C1_SDA)
PB12: U1.17(PB12/SPI2_NSS)
PB13: U1.16(PB13/SPI2_SCK)
PB14: U1.15(PB14/SPI2_MISO)
PB15: U1.14(PB15/SPI2_MOSI)
PH0: R4.2 SB13.1 U1.46(PH0-OSC_IN) ; port MCO  [project net MCO]
PH1: R3.2 U1.45(PH1-OSC_OUT)
STLINK_RX: SB29.1 ; port STLINK_RX
STLINK_TX: SB28.1 ; port STLINK_TX
STSAFE_nRST: JP10.2 U1.31(STSAFE_nRST) ; port STSAFE_nRST
SX1276_DIO0: U1.13(DBG_SX1276_DIO0)
SX1276_DIO1: U1.12(DBG_SX1276_DIO1)
SX1276_DIO2: U1.8(DBG_SX1276_DIO2)
SX1276_DIO3: U1.9(DBG_SX1276_DIO3)
SX1276_DIO4: SB26.1 U1.10(SX1276_DIO4)
SX1276_DIO5: SB27.1 U1.11(DBG_SX1276_DIO5)
TCXO_OUT: SB13.2 U1.47(TCXO_OUT)
TCXO_VCC: JP9.2 U1.48(TCXO_VCC) ; port TCXO_VCC
NetC1_1: C1.1 R4.1 X1.1(OSC1)
NetC2_1: C2.1 R3.1 X1.2(OSC2)

### Buses and harness runs
bus CRF[1..3] = port CRF[1..3]
bus PA[0..15] = port PA[0..15]
bus PB[0..15] = port PB[0..15]
bus PC[0..15] = port PC[0..15]
bus PH[0..1] = port PH[0..1]
bus SX1276_DIO[0..5] = port SX1276_DIO[0..5]

### Notes on the sheet
- C1, C2, X1, R3, R4, SB13 and SB14 must be placed the closest as possible from U1
- (near SB13) Not fitted
- (near R1) Not fitted
- /OSC_IN
- /OSC_OUT
- /SWCLK
- /SWDIO
- /LPTIM1_IN1
- /LPTIM1_ETR
- /LPTIM1_IN2
- /LPTIM1_OUT
- (near SB15) Not fitted
- (near SB16) Not fitted
- /USB_DP
- /USB_DM
- /I2C1_SDA
- /I2C1_SCL
- Decoupling capacitors
- (near U1) LoRa Module (Murata)
- (near C3) Not fitted
- (near C4) Not fitted
- /SPI2_MOSI
- /SPI2_MISO
- /SPI2_SCK
- /SPI2_NSS
- /USART1_RX
- /USART1_TX
- /MCO
- (near R40) R40 is soldered on the PCB between the capacitors pads of C8 and C9.
- (near SB26) Not fitted
- Not fitted
- Fitted
- /ADC5/DAC2
- /ADC4/DAC1
- /ADC3
- /ADC2
- (near C8) Not fitted
- (near C9) Not fitted
- Title:
- Project:
- Size:
- Date:
- A4
- Reference:
- Sheet:
- Revision:
- of

### Library data of the parts
C1 C2 = Capacitor_ST: Capacitor 0603; Manufacturer: YAGEO; Manufacturer P/N: CC0603JRNPO9BN200; Value: 20pF; Fitted: No; Provided by: Subcon; Revision: July-2002: Re-released for DXP Platform.; ECCN_US/UE: *; Order Code Digikey: *; Order Code Farnell: *; Order Code RS: *
C3 = CAP SMD 0603  X5R 1µF 25V 10%: 0603  X5R 1µF; Manufacturer: YAGEO; Manufacturer P/N: CC0603KRX5R7BB105; Fitted: No; Provided by: Subcon; Order code Farnell: 1288202RL; Value: 1µF; ECCN_US/UE: *; Order Code Digikey: *
C4 C11 = CAP: Capacitor 100nF; Manufacturer: YAGEO; Manufacturer P/N: CC0603KRX7R9BB104; Fitted: No; Provided by: Subcon; Revision: July-2002: Re-released for DXP Platform.; Value: 100nF; ECCN_US/UE: *; Order Code Digikey: *; Order Code Farnell: *; Order Code RS: *
C5-C7 = CAP_C0805C106K8RACTU: Capacitor SMD 0805 10000000pF X7R 10V +/-10%; Manufacturer: Kemet; Order code RS: ...; Tolerance: 10%; Fitted: Yes; Manufacturer P/N: C0805C106K8RACTU; Order code Farnell: 2118132; Value: 10µF; Rated voltage: 10V; Technology: X7R; Temperature Max: +125°C; Temperature Min: -55°C; Order code Digikey: 399-7411-1-ND
C8 C9 = CAP: as C16 on sheet MB1296-USB_Antenna; Revision: July-2002: Re-released for DXP Platform.; Value: 100nF; ECCN_US/UE: *; Fitted: *; Order Code Digikey: *; Order Code Farnell: *; Order Code RS: *
C10 = CAP SMD 0603  X5R 1µF 25V 10%: as C30 on sheet MB1296-STLINK; Order code Farnell: 1288202RL; Value: 1µF; ECCN_US/UE: *; Fitted: *; Order Code Digikey: *
JP9 JP10 = Header 3: Manufacturer: Kontek; Manufacturer P/N: 4710334140400; Order Code RS: 423-2835; Provided by: Subcon; Order Code Farnell: *; ECCN_US/UE: *; Fitted: *; Order Code Digikey: *; Value: *
R1 = RES SMD 0603 0R 50V 0.1W: 0603 0R 50V 0.1W; Manufacturer: YAGEO; Manufacturer P/N: RC0603JR-070RL; Order code RS: 6555461; Fitted: No; Order code Farnell: 9233130; Value: 0R; ECCN_US/UE: *; Order Code Digikey: *; Provided by: *
R2 R40 = RES SMD 0603 100K 75V 5% 0.1W: as R9 on sheet MB1296-USB_Antenna; Order code Farnell: 1692517; Value: 100K; ECCN_US/UE: *; Fitted: *; Order Code Digikey: *
R3 R4 = RES SMD 0603 0R 50V 0.1W: 0603 0R 50V 0.1W; Manufacturer: YAGEO; Manufacturer P/N: RC0603JR-070RL; Order code RS: 6555461; Order code Farnell: 9233130; Value: 0R; ECCN_US/UE: *; Fitted: *; Order Code Digikey: *; Provided by: *
SB13 SB15 SB16 SB26 SB27 = Circuit Breaker: Fitted: No; Revision: July-2002: Re-released for DXP Platform.; ECCN_US/UE: *; Manufacturer: *; Manufacturer P/N: *; Order Code Digikey: *; Order Code Farnell: *; Order Code RS: *; Provided by: *; Value: *
SB28 SB29 = Circuit Breaker: Fitted: Yes; Revision: July-2002: Re-released for DXP Platform.; ECCN_US/UE: *; Manufacturer: *; Manufacturer P/N: *; Order Code Digikey: *; Order Code Farnell: *; Order Code RS: *; Provided by: *; Value: *
U1 = LRA Module ES0: Manufacturer: Murata; Manufacturer P/N: LoRa Module ES0; ECCN_US/UE: *; Fitted: *; Order Code Digikey: *; Order Code Farnell: *; Order Code RS: *; Provided by: Murata; Value: *
X1 = XTAL: Crystal Oscillator; Manufacturer: HongKongCrystal; Manufacturer P/N: 9SL8000012AFXHF0-SJ28; Fitted: No; Provided by: Subcon; Value: 8MHz; ECCN_US/UE: *; Order Code Digikey: *; Order Code Farnell: *; Order Code RS: *

## Sheet MB1296-Power.SchDoc: Power
size A4; Date: 18-AUG-2016; Organization: STMicroelectronics; Address1: Microcontrollers Division; Address2: 190, avenue Célestin COQ; Address3: 13106 ROUSSET Cedex; Address4: FRANCE; DocumentNumber: MB1296; Revision: C-01; SheetNumber: 2; SheetTotal: 6; Project: STM32 LoRa Discovery
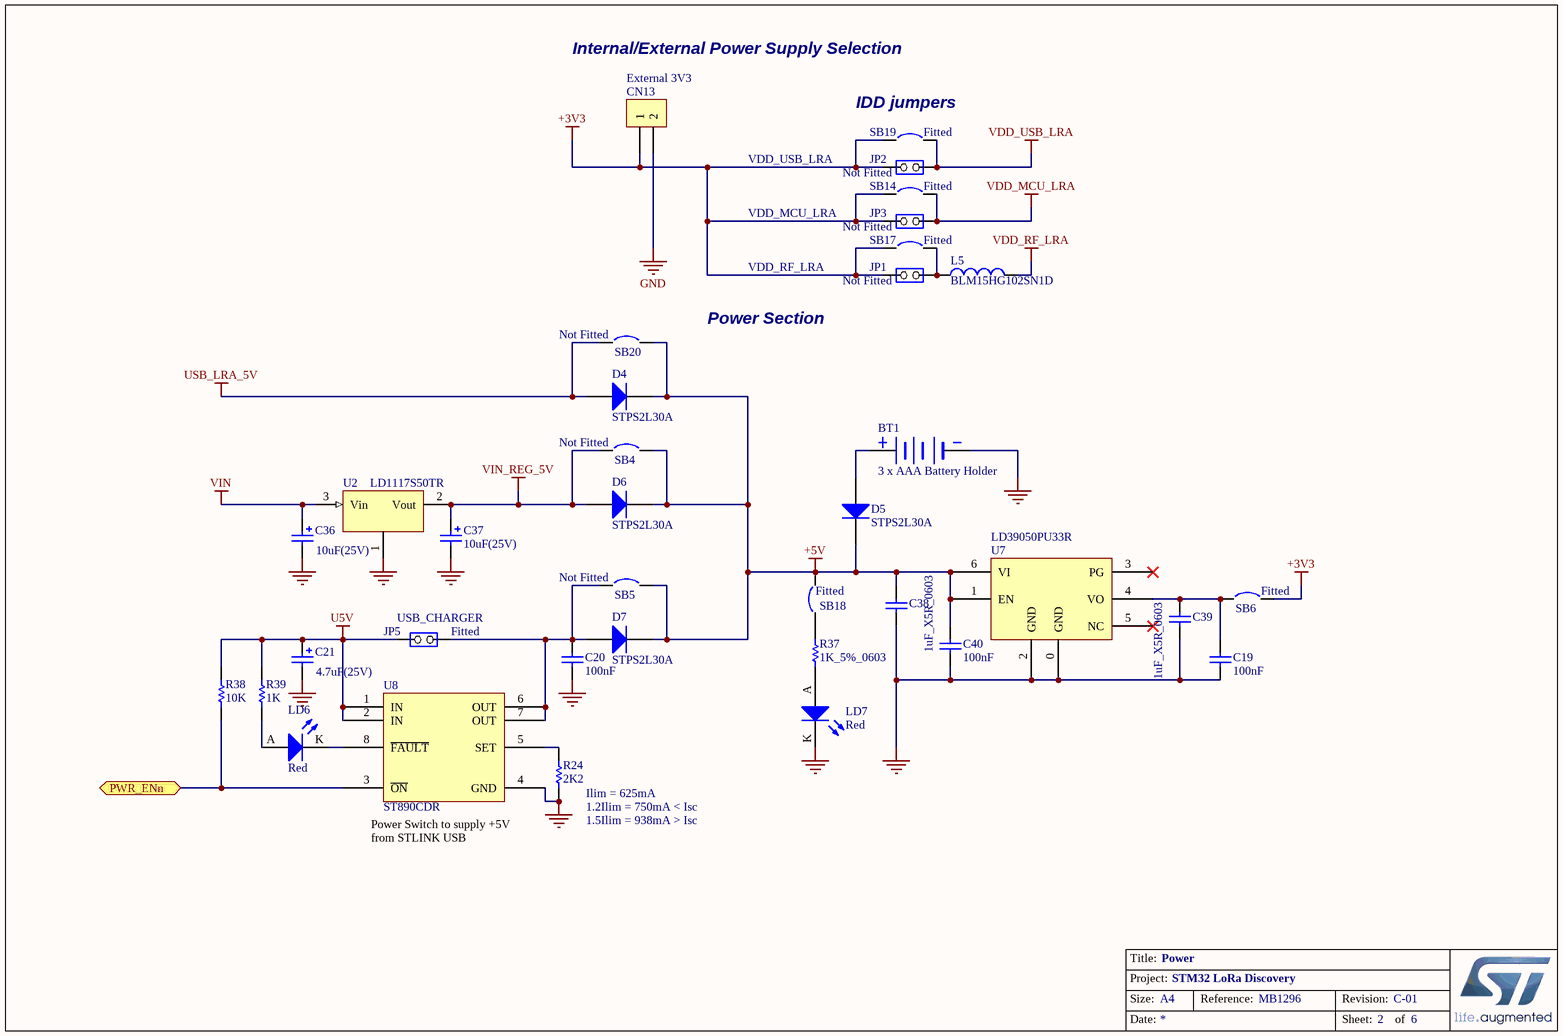
[diagram p5: MB1296-Power.SchDoc]

### Parts
BT1  3 x AAA Battery Holder  [3 X AAA Battery Holder]
C19  100nF  [0603C]
C20  100nF  [0603C]
C21  4.7uF(25V)  [TAN-B]
C36  10uF(25V)  [TAN-B]
C37  10uF(25V)  [TAN-B]
C38  1uF_X5R_0603  [0603C]
C39  1uF_X5R_0603  [0603C]
C40  100nF  [0603C]
CN13  External 3V3  [SIP2]
D4  STPS2L30A  [SMA]
D5  STPS2L30A  [SMA]
D6  STPS2L30A  [SMA]
D7  STPS2L30A  [SMA]
JP1  VDD_RF_LRA  [SIP2/2.54]
JP2  VDD_USB_LRA  [SIP2/2.54]
JP3  VDD_MCU_LRA  [SIP2/2.54]
JP5  USB_CHARGER  [SIP2/2.54]
L5  BLM15HG102SN1D  [0402]
LD6  Red  [0603D]
LD7  Red  [0603D]
R24  2K2  [0603R]
R37  1K_5%_0603  [0603]
R38  10K  [0603R]
R39  1K  [0603R]
SB4  Circuit Breaker  [JP2_SMD]  (value not drawn)
SB5  Circuit Breaker  [JP2_SMD]  (value not drawn)
SB6  Circuit Breaker  [JP2_SMD]  (value not drawn)
SB14  Circuit Breaker  [JP2_SMD]  (value not drawn)
SB17  Circuit Breaker  [JP2_SMD]  (value not drawn)
SB18  Circuit Breaker  [JP2_SMD]  (value not drawn)
SB19  Circuit Breaker  [JP2_SMD]  (value not drawn)
SB20  Circuit Breaker  [JP2_SMD]  (value not drawn)
U2  LD1117S50TR  [SOT-223]
U7  LD39050PU33R  [DFN6(3X3)]
U8  ST890CDR  [SOIC8_1R27_4R9X6]

### Ports
PWR_ENn

### Nets
+3V3: CN13.1 JP1.2(NO) JP2.2(NO) JP3.2(NO) SB6.2 SB14.1 SB17.1 SB19.1
+5V: C38.2 C40.2 D4.2(K) D5.2(K) D6.2(K) D7.2(K) SB4.2 SB5.2 SB18.2 SB20.2 U7.1(EN) U7.6(VI)
GND: BT1.2(-) C19.1 C20.1 C21.2 C36.2 C37.2 C38.1 C39.1 C40.1 CN13.2 LD7.K R24.2 U2.1 U7.0(GND) U7.2(GND) U8.4(GND)
U5V: C21.1 JP5.2(NO) R38.2 R39.2 U8.1(IN) U8.2(IN)
USB_LRA_5V: D4.1(A) SB20.1
VDD_MCU_LRA: JP3.1(COMMON) SB14.2  [project net VREF+]
VDD_RF_LRA: L5.2
VDD_USB_LRA: JP2.1(COMMON) SB19.2
VIN: C36.1 U2.3(Vin)
VIN_REG_5V: C37.1 D6.1(A) SB4.1 U2.2(Vout)
PWR_ENn: R38.1 U8.3(~{ON}) ; port PWR_ENn
NetBT1_1: BT1.1(+) D5.1(A)
NetC19_2: C19.2 C39.2 SB6.1 U7.4(VO)
NetC20_2: C20.2 D7.1(A) JP5.1(COMMON) SB5.1 U8.6(OUT) U8.7(OUT)
NetJP1_1: JP1.1(COMMON) L5.1 SB17.2
NetLD6_A: LD6.A R39.1
NetLD6_K: LD6.K U8.8(~{FAULT})
NetLD7_A: LD7.A R37.1
NetR24_1: R24.1 U8.5(SET)
NetR37_2: R37.2 SB18.1

Not connected (* = marked no-connect by the designer): U7 3(PG)* 5(NC)*

### Notes on the sheet
- Internal/External Power Supply Selection
- (near SB19) IDD jumpers
- (near JP2) Not Fitted
- (near SB19) Fitted
- (near JP3) Not Fitted
- (near SB17) Fitted
- (near SB14) Fitted
- (near JP1) Not Fitted
- (near SB20) Not Fitted
- Power Section
- (near SB4) Not Fitted
- (near SB5) Not Fitted
- (near JP5) Fitted
- (near SB18) Fitted
- (near SB6) Fitted
- Power Switch to supply +5V from STLINK USB
- (near R24) Ilim = 625mA
- (near R24) 1.2Ilim = 750mA < Isc
- (near R24) 1.5Ilim = 938mA > Isc
- Title:
- Project:
- Size:
- Date:
- A4
- Reference:
- Sheet:
- Revision:
- of

### Library data of the parts
BT1 = 3 x AAA Battery Holder: Manufacturer: Keystone; Manufacturer P/N: 2479; Order Code Farnell: *; Order Code RS: *; Order Code Digikey: 36-2479-ND; ECCN_US/UE: *; Fitted: *; Provided by: *; Value: *
C19 C20 C40 = CAP: as C16 on sheet MB1296-USB_Antenna; Revision: July-2002: Re-released for DXP Platform.; Value: 100nF; ECCN_US/UE: *; Fitted: *; Order Code Digikey: *; Order Code Farnell: *; Order Code RS: *
C21 = Cap Pol1: Polarized Capacitor (Radial); Manufacturer: YAGEO; Manufacturer P/N: CC1206KKX7R8BB475; Provided by: Subcon; Revision: July-2002: Re-released for DXP Platform.; Value: 4.7uF; ECCN_US/UE: *; Fitted: *; Order Code Digikey: *; Order Code Farnell: *; Order Code RS: *
C36 C37 = Cap Pol1: Polarized Capacitor (Radial); Manufacturer: AVX; Manufacturer P/N: TAJB106K025R; Provided by: Subcon; Revision: July-2002: Re-released for DXP Platform.; Value: 10uF; ECCN_US/UE: *; Fitted: *; Order Code Digikey: *; Order Code Farnell: *; Order Code RS: *
C38 C39 = CAP SMD 0603  X5R 1µF 25V 10%: as C30 on sheet MB1296-STLINK; Order code Farnell: 1288202RL; Value: 1µF; ECCN_US/UE: *; Fitted: *; Order Code Digikey: *
CN13 = Header 2: Manufacturer: Kontek; Manufacturer P/N: 4710334140400; Order Code RS: 423-2835; Provided by: Subcon; Order Code Farnell: *; ECCN_US/UE: *; Fitted: *; Order Code Digikey: *; Value: *
D4-D7 = STPS2L30A: Provided by: STM; Order: BAT60JFILM; ECCN_US/EU: EAR99/NEC; Revision: July-2002: Re-released for DXP Platform.; Manuf_Part_1: BAT60JFILM; Manuf_1: STM; Distrib: ST; Fitted: *; Value: *
JP1-JP3 JP5 = JP2: Manufacturer: Lyconn; Manufacturer P/N: 313140S111116; Fitted: No; Provided by: Subcon; ECCN_US/UE: *; Order Code Digikey: *; Order Code Farnell: *; Order Code RS: *; Value: *
L5 = BLM15HG102SN1D: Manufacturer: Murata Electronics; Manufacturer P/N: BLM15HG102SN1D; Order Code Mouser: 81-BLM15HG102SN1D; ECCN_US/UE: *; Fitted: *; Order Code Digikey: *; Order Code Farnell: *; Order Code RS: *; Provided by: *; Value: *
LD6 LD7 = LED2: as LD1 on sheet MB1296-USB_Antenna; Revision: July-2002: Re-released for DXP Platform.; ECCN_US/UE: *; Fitted: *; Order Code Digikey: *; Order Code Farnell: *; Order Code RS: *; Provided by: *; Value: *
R24 = Res1_2: Resistor; Manufacturer: YAGEO; Manufacturer P/N: RC0603FR-072K2L; Provided by: Subcon; Value: 2K7; Revision: July-2002: Re-released for DXP Platform.; ECCN_US/UE: *; Fitted: *; Order Code Digikey: *; Order Code Farnell: *; Order Code RS: *
R37 = RES SMD 0603 1K 50V 5% 0.063W: 0603 1K 50V 5% 0.063W; Manufacturer: YAGEO; Manufacturer P/N: RC0603FR-071KL; Order code RS: 461-3818; Provided by: Subcon; Value: 1K; ECCN_US/UE: *; Fitted: *; Order Code Digikey: *
R38 = Resistor_ST: as R15 on sheet MB1296-Connectors; Value: 10K; ECCN_US/UE: *; Fitted: *; Order Code Digikey: *; Order Code Farnell: *; Order Code RS: *
R39 = Resistor_ST: Resistor 0603; Manufacturer: YAGEO; Manufacturer P/N: RC0603FR-071KL; Provided by: Subcon; Value: 1K; ECCN_US/UE: *; Fitted: *; Order Code Digikey: *; Order Code Farnell: *; Order Code RS: *
SB4 SB5 SB20 = Circuit Breaker: Fitted: No; Revision: July-2002: Re-released for DXP Platform.; ECCN_US/UE: *; Manufacturer: *; Manufacturer P/N: *; Order Code Digikey: *; Order Code Farnell: *; Order Code RS: *; Provided by: *; Value: *
SB6 SB14 SB17-SB19 = Circuit Breaker: Fitted: Yes; Revision: July-2002: Re-released for DXP Platform.; ECCN_US/UE: *; Manufacturer: *; Manufacturer P/N: *; Order Code Digikey: *; Order Code Farnell: *; Order Code RS: *; Provided by: *; Value: *
U2 = LD1117: Manufacturer: ST; ECCN_US/UE: EAR99/NEC; Provided by: STM; Fitted: *; Manufacturer P/N: LD1117S50TR; Order Code Digikey: *; Order Code Farnell: *; Order Code RS: *; Value: *
U7 = LD39050P: Manufacturer: ST; ECCN_US/UE: EAR99/NEC; Provided by: STM; Fitted: *; Manufacturer P/N: LD39050PU33R; Order Code Digikey: *; Order Code Farnell: *; Order Code RS: *; Value: *
U8 = ST890CDR: Manufacturer: ST; Manufacturer P/N: ST890R; ECCN_US/UE: EAR99/NEC; Provided by: STM; Fitted: *; Order Code Digikey: *; Order Code Farnell: *; Order Code RS: *; Value: *

## Nets that join several sheets
+3V3: MB1296-Connectors (CN2.19 CN4.2 CN4.4), MB1296-STLINK (R26.1), MB1296-Power (8 pins)
+5V: MB1296-Connectors (CN2.20 CN4.5 R15.1), MB1296-STLINK (D2.1), MB1296-Power (12 pins)
GND: MB1296-Connectors (11 pins), MB1296-USB_Antenna (26 pins), MB1296-STLINK (44 pins), MB1296-LRA_Module (26 pins), MB1296-Power (16 pins)
U5V: MB1296-STLINK (5 pins), MB1296-Power (6 pins)
USB_LRA_5V: MB1296-USB_Antenna (C18.2 CN11.1 U6.5), MB1296-Power (D4.1 SB20.1)
VDD_RF_LRA: MB1296-Connectors (CN2.4), MB1296-LRA_Module (5 pins), MB1296-Power (L5.2)
VDD_USB_LRA: MB1296-Connectors (CN2.6), MB1296-LRA_Module (C5.1 C8.2 R40.2 U1.4), MB1296-Power (JP2.1 SB19.2)
VIN: MB1296-Connectors (CN2.21 CN4.8), MB1296-Power (C36.1 U2.3)
VIN_REG_5V: MB1296-STLINK (D8.1), MB1296-Power (C37.1 D6.1 SB4.1 U2.2)
VREF+: MB1296-Connectors (CN1.8 CN2.2 CN3.5), MB1296-USB_Antenna (R5.2), MB1296-LRA_Module (8 pins), MB1296-Power (JP3.1 SB14.2)
ANT: MB1296-USB_Antenna (C13.2 C14.1), MB1296-LRA_Module (U1.26)
BOOT0: MB1296-Connectors (CN2.8), MB1296-LRA_Module (R1.1 R2.2 U1.43)
CRF1: MB1296-Connectors (CN3.1), MB1296-LRA_Module (U1.28)
CRF2: MB1296-Connectors (CN3.2), MB1296-LRA_Module (U1.30)
CRF3: MB1296-Connectors (CN3.3), MB1296-LRA_Module (U1.29)
LRA_USB_N: MB1296-USB_Antenna (CN11.2 U6.1 U6.6), MB1296-LRA_Module (SB16.1)
LRA_USB_P: MB1296-USB_Antenna (CN11.3 U6.3 U6.4), MB1296-LRA_Module (SB15.1)
MCO: MB1296-Connectors (CN2.26 SB1.2), MB1296-STLINK (SB36.2), MB1296-LRA_Module (R4.2 SB13.1 U1.46)
MCU_nRST: MB1296-Connectors (CN2.18 CN4.3), MB1296-USB_Antenna (B2.2 B2.3 C17.2), MB1296-STLINK (SB37.2), MB1296-LRA_Module (JP10.1 U1.34)
PA0: MB1296-Connectors (CN2.23 CN6.1 SB7.1), MB1296-USB_Antenna (SB30.1), MB1296-LRA_Module (U1.33)
PA2: MB1296-Connectors (CN3.22 CN5.2), MB1296-LRA_Module (SB29.2 U1.24)
PA3: MB1296-Connectors (CN3.23 CN5.1), MB1296-LRA_Module (SB28.2 U1.23)
PA4: MB1296-Connectors (CN2.24 CN6.3 SB8.1), MB1296-LRA_Module (SB27.2 U1.22)
PA5: MB1296-Connectors (CN3.7 SB3.1), MB1296-USB_Antenna (SB34.1), MB1296-LRA_Module (SB26.2 U1.21)
PA8: MB1296-Connectors (CN3.18 CN5.8), MB1296-LRA_Module (U1.20)
PA9: MB1296-Connectors (CN1.1 CN3.13), MB1296-LRA_Module (U1.19)
PA10: MB1296-Connectors (CN3.21 CN5.3), MB1296-LRA_Module (U1.18)
PA11: MB1296-Connectors (CN3.15), MB1296-LRA_Module (JP10.3 SB16.2 U1.2)
PA12: MB1296-Connectors (CN3.14), MB1296-LRA_Module (JP9.1 SB15.2 U1.1)
PA13: MB1296-Connectors (CN2.9), MB1296-STLINK (SB24.1), MB1296-LRA_Module (U1.41)
PA14: MB1296-Connectors (CN2.10), MB1296-STLINK (SB40.1), MB1296-LRA_Module (U1.42)
PB2: MB1296-Connectors (CN3.17 CN5.7), MB1296-USB_Antenna (SB31.1), MB1296-LRA_Module (U1.37)
PB5: MB1296-Connectors (CN3.20 CN5.5), MB1296-USB_Antenna (SB32.1), MB1296-LRA_Module (U1.40)
PB6: MB1296-Connectors (CN1.3 CN3.11), MB1296-USB_Antenna (SB33.1), MB1296-LRA_Module (U1.39)
PB7: MB1296-Connectors (CN3.19 CN5.6), MB1296-USB_Antenna (SB35.1), MB1296-LRA_Module (U1.38)
PB8: MB1296-Connectors (CN1.10 CN3.25 SB12.2), MB1296-LRA_Module (U1.35)
PB9: MB1296-Connectors (CN1.9 CN3.24 SB11.2), MB1296-LRA_Module (U1.36)
PB12: MB1296-Connectors (CN1.2 CN3.16), MB1296-LRA_Module (U1.17)
PB13: MB1296-Connectors (CN3.8 SB2.1 SB9.1), MB1296-LRA_Module (U1.16)
PB14: MB1296-Connectors (CN1.5 CN3.9), MB1296-LRA_Module (U1.15)
PB15: MB1296-Connectors (CN1.4 CN3.10), MB1296-LRA_Module (U1.14)
PH1: MB1296-Connectors (CN2.25 SB10.2), MB1296-LRA_Module (R3.2 U1.45)
PWR_ENn: MB1296-STLINK (U3.28), MB1296-Power (R38.1 U8.3)
STLINK_RX: MB1296-STLINK (JP6.1 U3.13), MB1296-LRA_Module (SB29.1)
STLINK_TX: MB1296-STLINK (JP6.2 U3.12), MB1296-LRA_Module (SB28.1)
STSAFE_nRST: MB1296-Connectors (CN3.4), MB1296-LRA_Module (JP10.2 U1.31)
SX1276_DIO0: MB1296-Connectors (CN2.11), MB1296-LRA_Module (U1.13)
SX1276_DIO1: MB1296-Connectors (CN2.12), MB1296-LRA_Module (U1.12)
SX1276_DIO2: MB1296-Connectors (CN2.13), MB1296-LRA_Module (U1.8)
SX1276_DIO3: MB1296-Connectors (CN2.14), MB1296-LRA_Module (U1.9)
SX1276_DIO4: MB1296-Connectors (CN2.15), MB1296-LRA_Module (SB26.1 U1.10)
SX1276_DIO5: MB1296-Connectors (CN2.16), MB1296-LRA_Module (SB27.1 U1.11)
TCXO_VCC: MB1296-Connectors (CN2.1), MB1296-LRA_Module (JP9.2 U1.48)